# Altium schematic sheet INV.Power.SchDoc
size 1050 x 400 mm; SheetNumber: 1; SheetTotal: 3
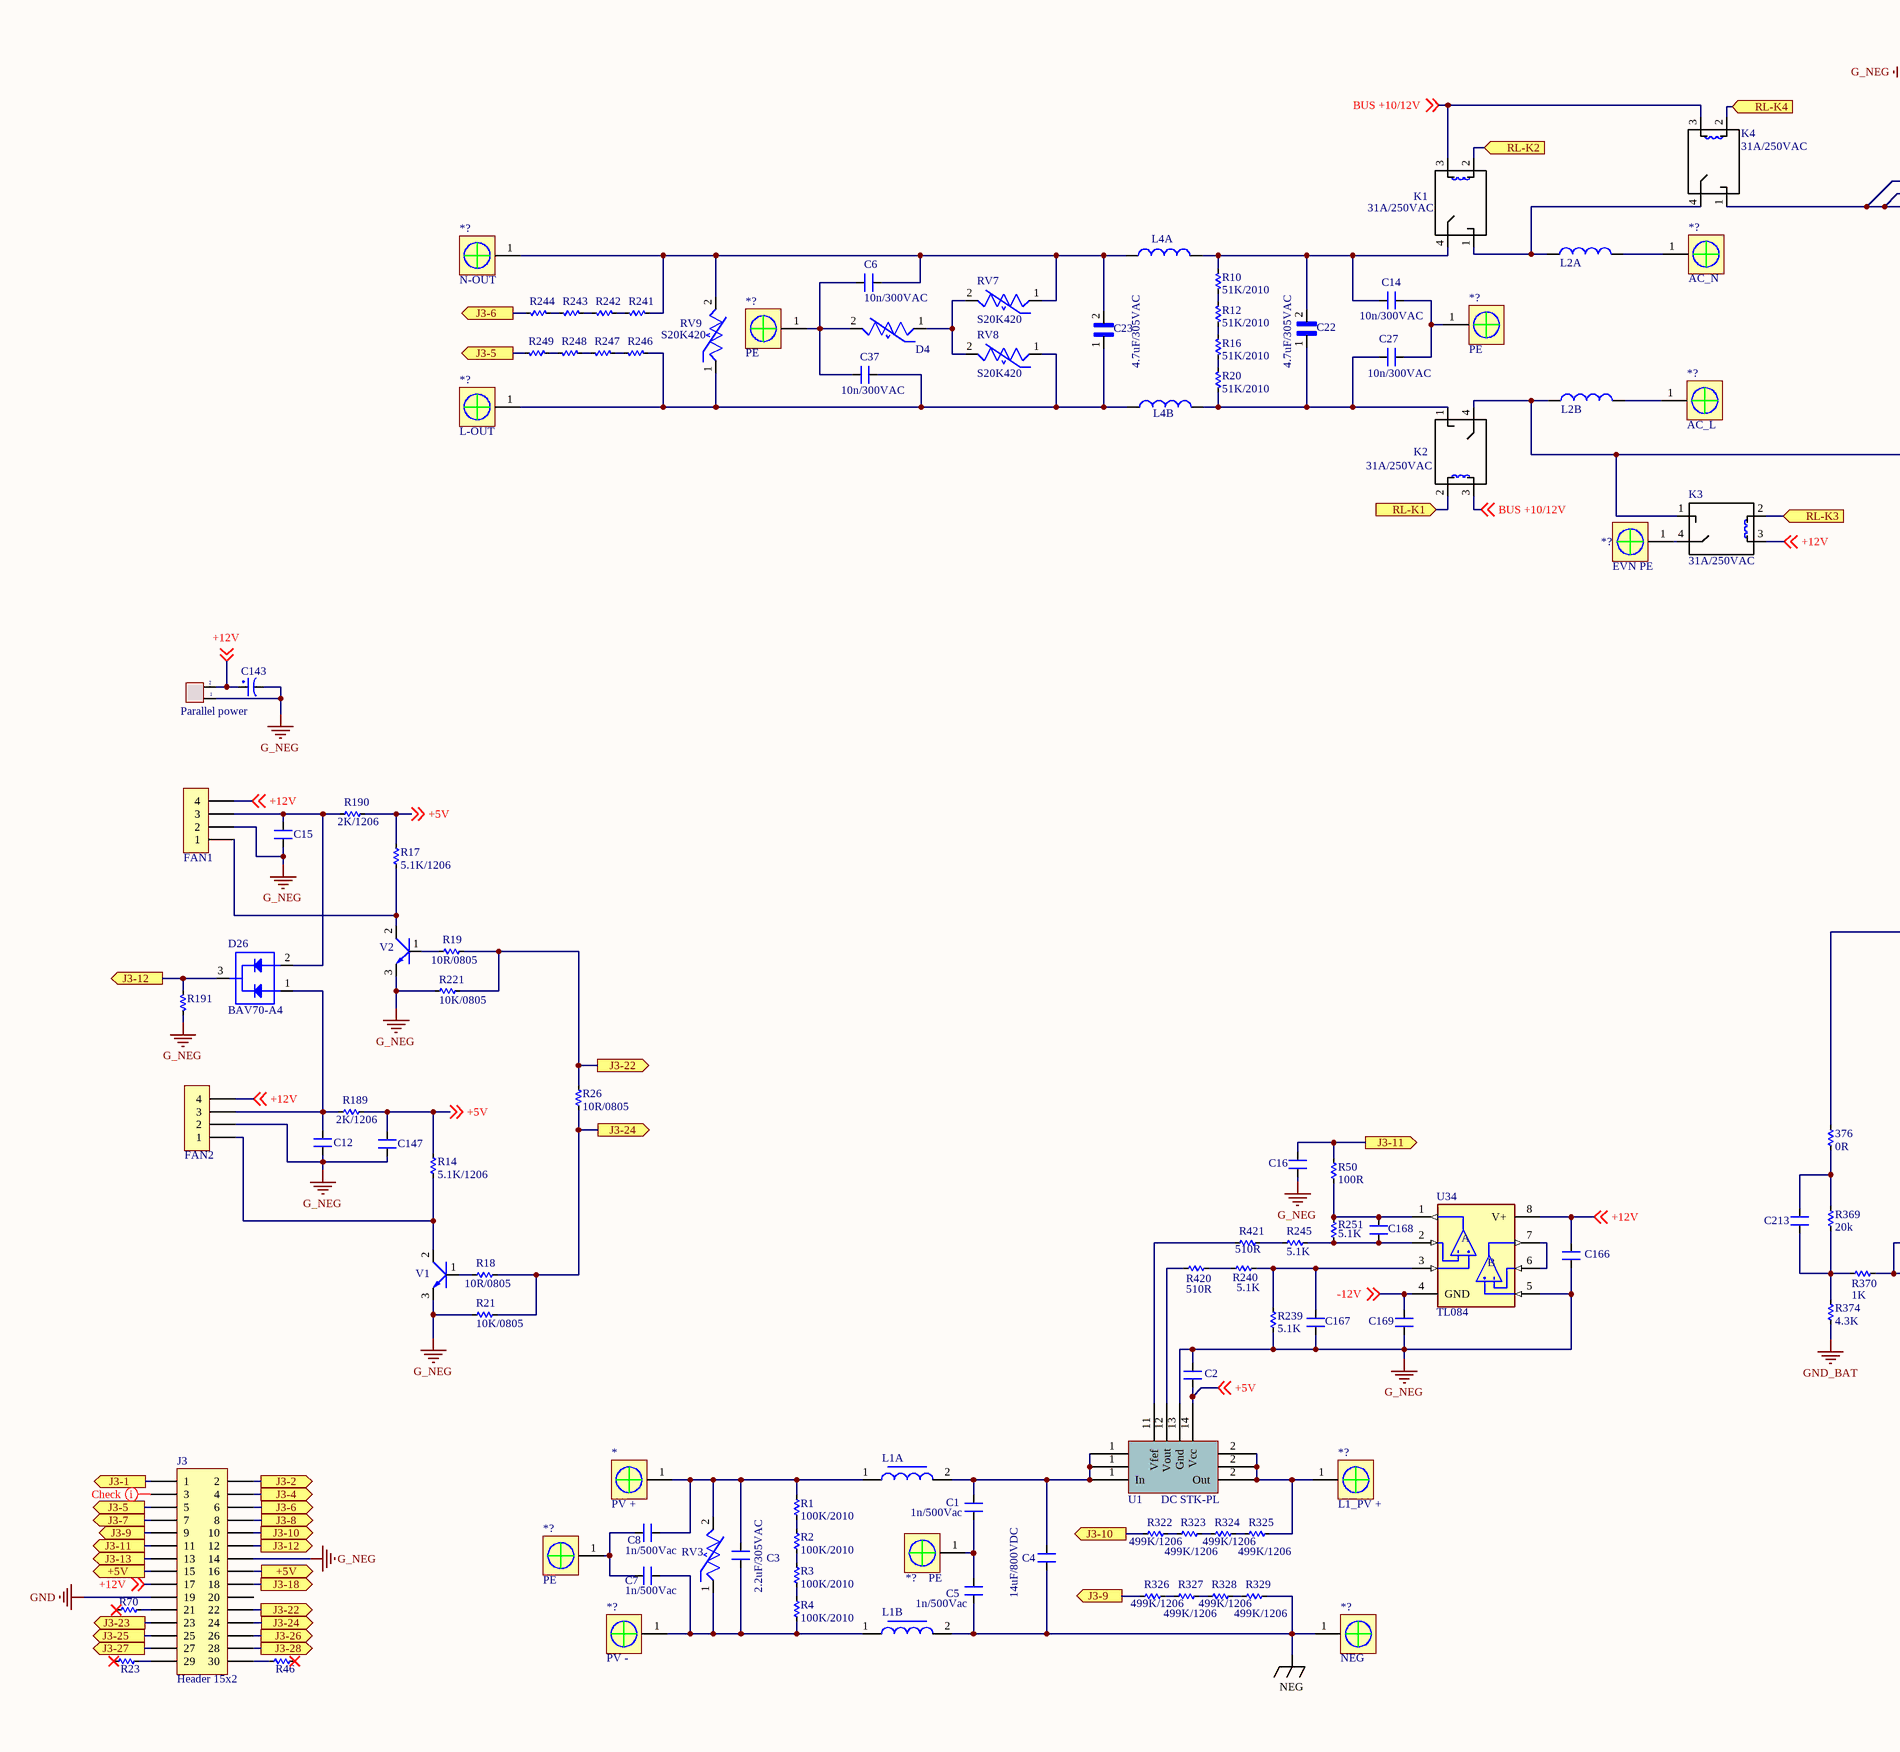
[diagram p0: INV.Power.SchDoc, left]
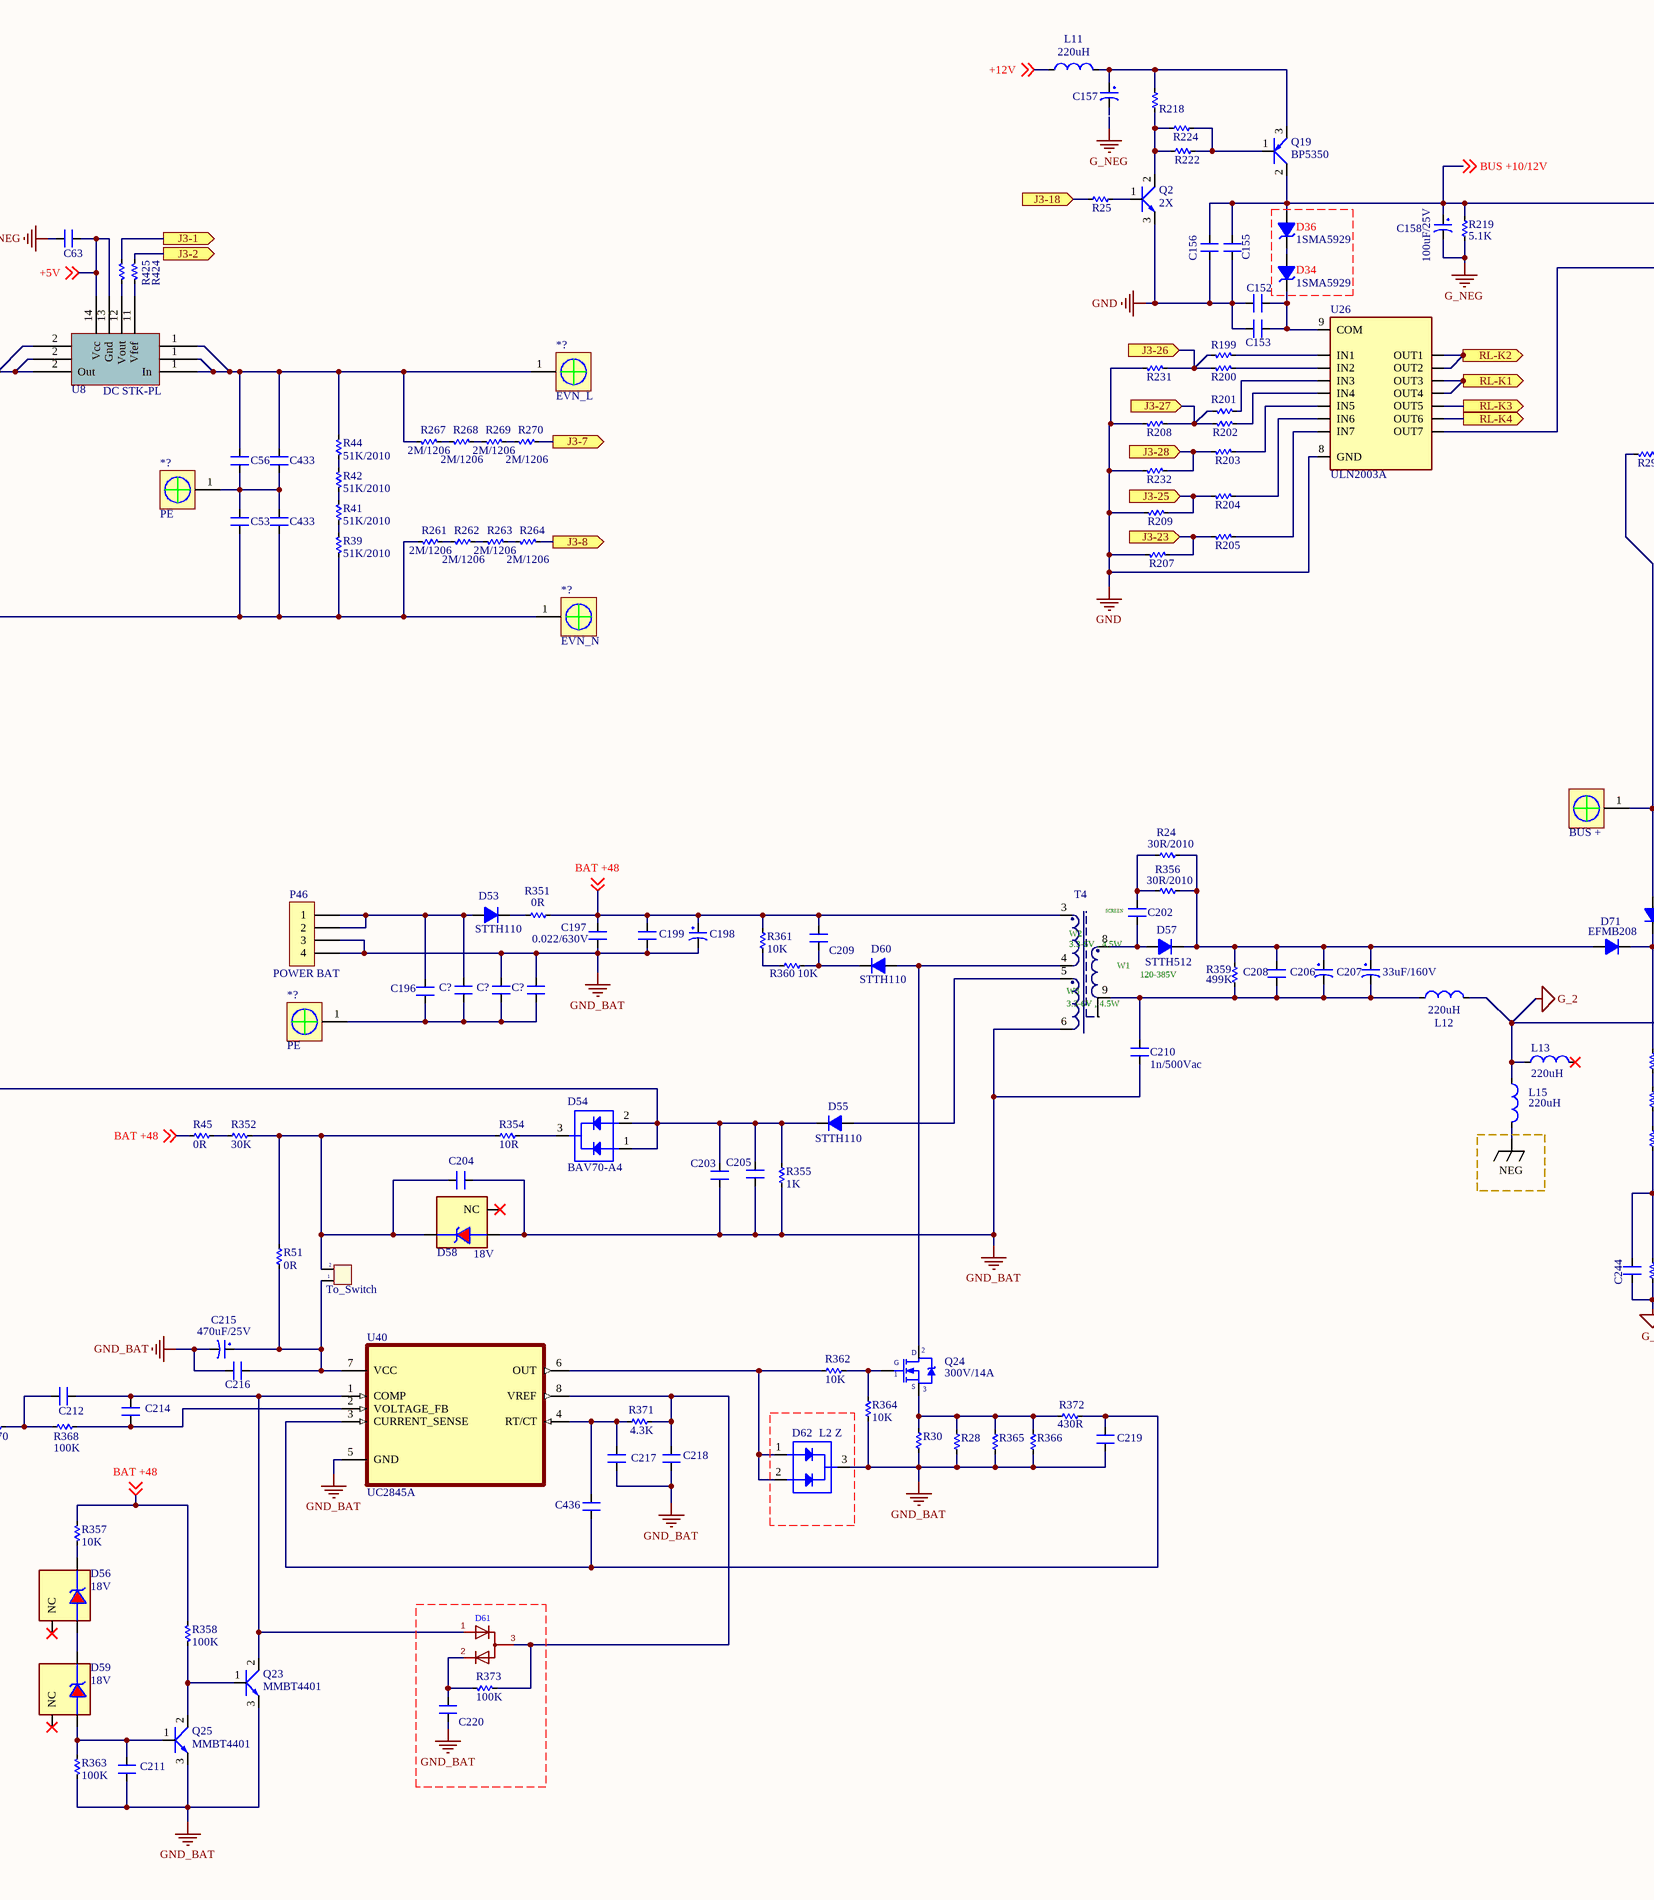
[diagram p1: INV.Power.SchDoc, middle]
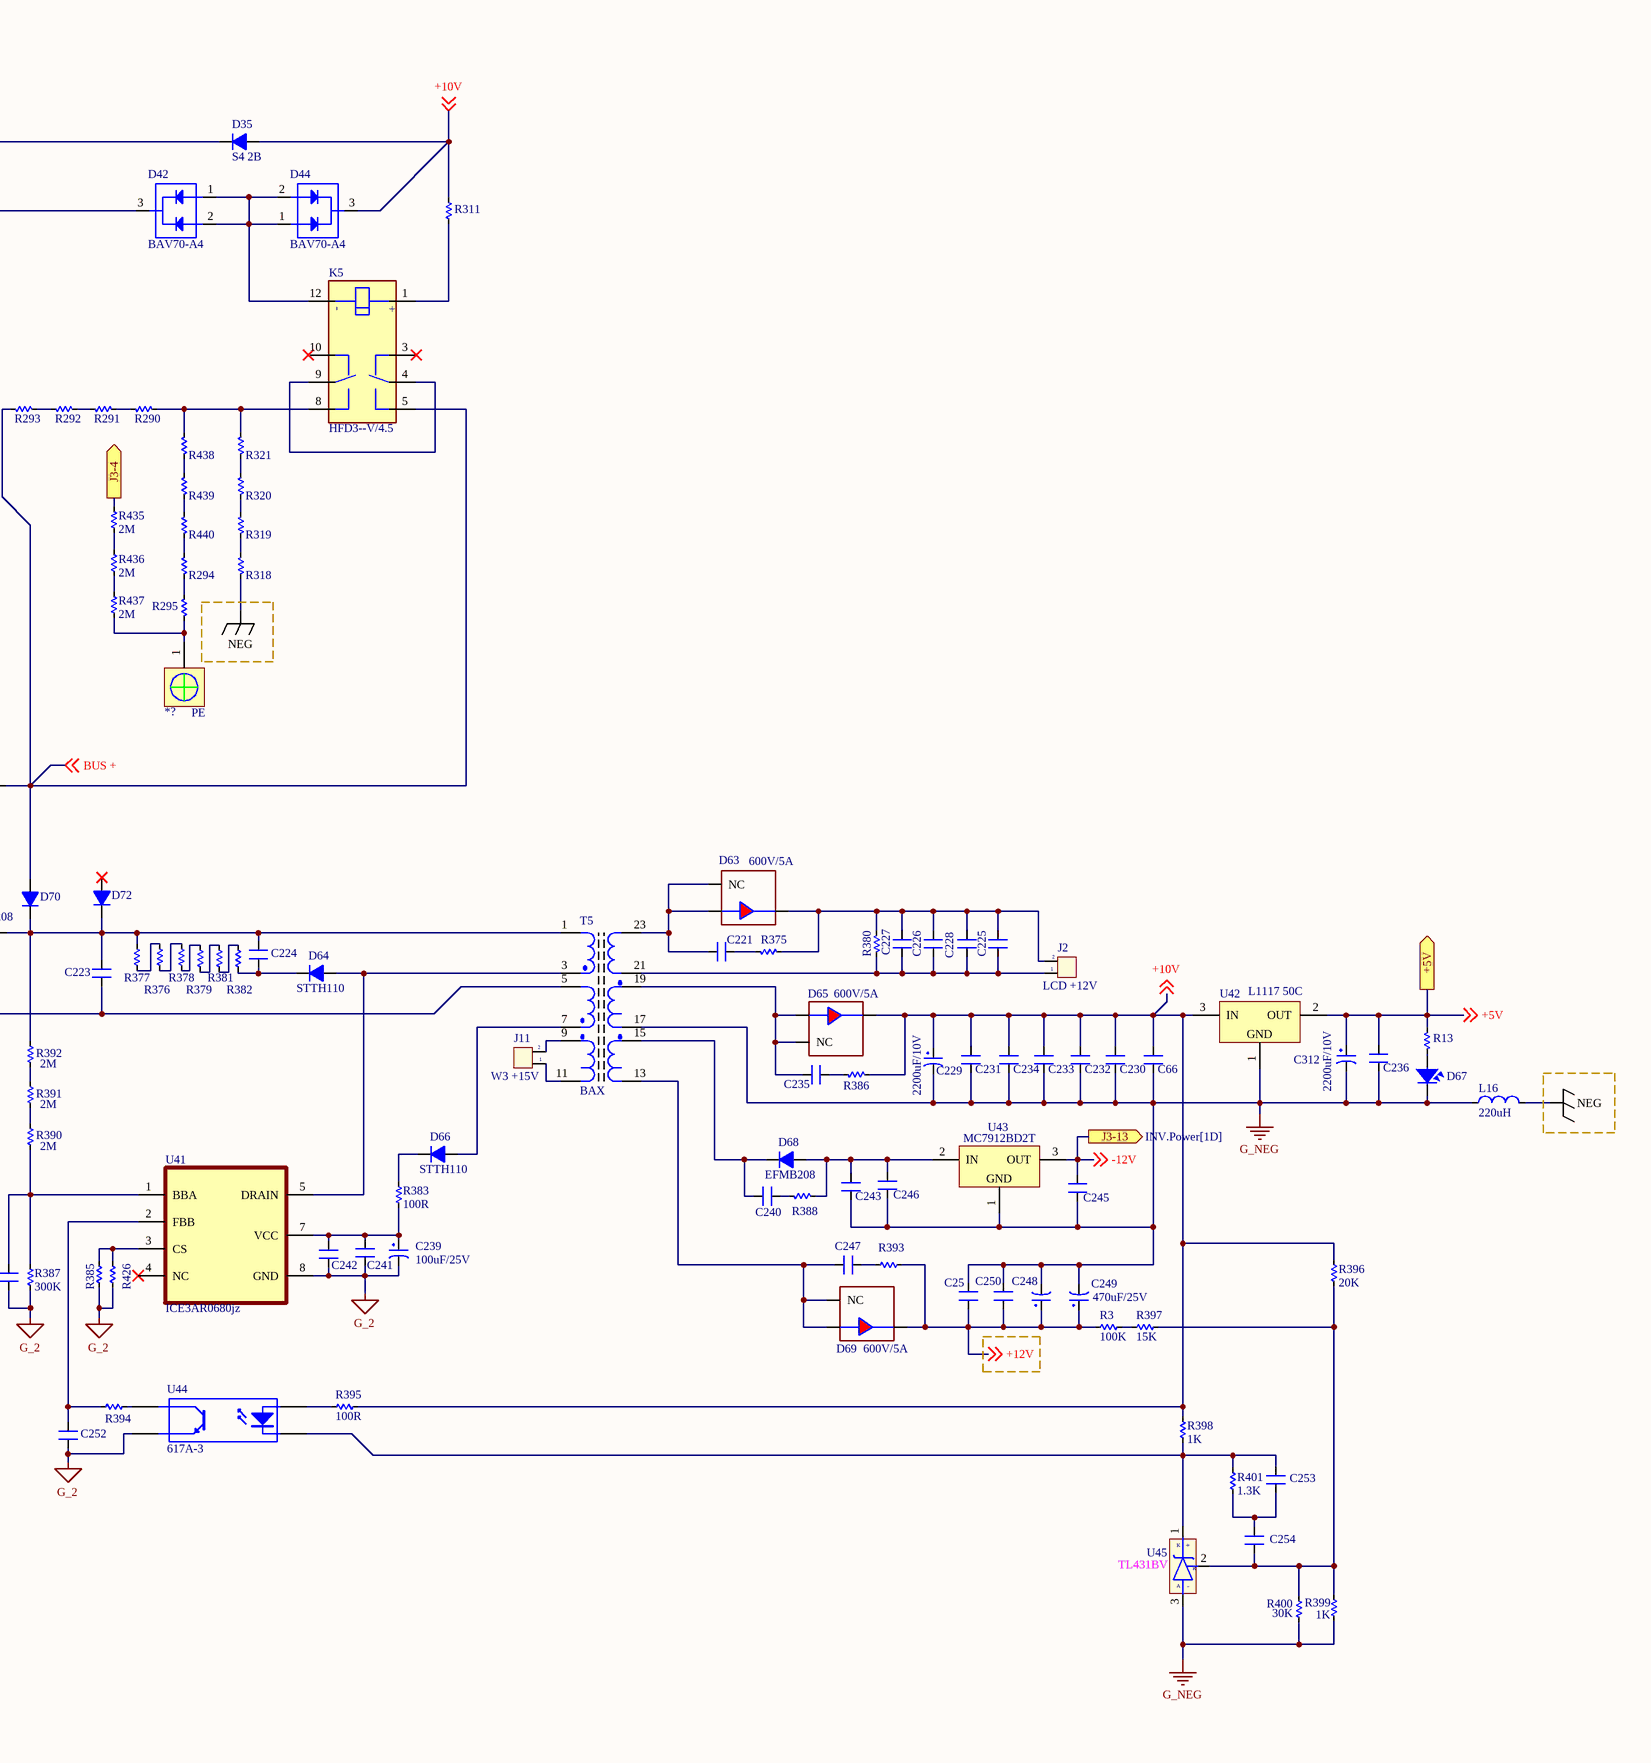
[diagram p2: INV.Power.SchDoc, right]

## Parts
(Parts that share a designator on the sheet are numbered #1, #2 ... from top to bottom, then left to right.)
376  0R  [RES-SMD-0603 EX]
*  PV +  [Copper Pipe]
*?#1  EVN_L  [Copper Pipe]
*?#2  N-OUT  [Copper Pipe]
*?#3  AC_N  [Copper Pipe]
*?#4  PE  [Copper Pipe]
*?#5  PE  [Copper Pipe]
*?#6  PE  [Copper Pipe]
*?#7  AC_L  [Copper Pipe]
*?#8  L-OUT  [Copper Pipe]
*?#9  EVN_N  [Copper Pipe]
*?#10  PE  [Copper Pipe]
*?#11  EVN PE  [Copper Pipe]
*?#12  PE  [Copper Pipe]
*?#13  L1_PV +  [Copper Pipe]
*?#14  PE  [Copper Pipe]
*?#15  PE  [Copper Pipe]
*?#16  PV -  [Copper Pipe]
*?#17  NEG  [Copper Pipe]
C1  1n/500Vac  [CAP-SMD-0805 EX]
C2  (no value)  [CAP-SMD-0805 EX]
C3  2.2uF/305VAC  [CAP-SMD-0805 EX]
C4  14uF/800VDC  [CAP-SMD-0805 EX]
C5  1n/500Vac  [CAP-SMD-0805 EX]
C6  10n/300VAC  [CAP-SMD-0805 EX]
C7  1n/500Vac  [CAP-SMD-0805 EX]
C8  1n/500Vac  [CAP-SMD-0805 EX]
C12  (no value)  [CAP-SMD-0805 EX]
C14  10n/300VAC  [CAP-SMD-0805 EX]
C15  (no value)  [CAP-SMD-0805 EX]
C16  (no value)  [CAP-SMD-0805 EX]
C22  4.7uF/305VAC  [CAPRR2250W80L2600T850H1500]
C23  4.7uF/305VAC  [CAPRR2250W80L2600T850H1500]
C25  (no value)  [CAP-SMD-0805 EX]
C27  10n/300VAC  [CAP-SMD-0805 EX]
C37  10n/300VAC  [CAP-SMD-0805 EX]
C53  10n/300VAC  [CAP-SMD-0805 EX]  (value not drawn)
C56  10n/300VAC  [CAP-SMD-0805 EX]  (value not drawn)
C63  10n/300VAC  [CAP-SMD-0805 EX]  (value not drawn)
C66  (no value)  [CAP-SMD-0805 EX]
C143  470uF/25V  [CAP-10X17-N]  (value not drawn)
C147  (no value)  [CAP-SMD-0805 EX]
C152  (no value)  [CAP-SMD-0805 EX]
C153  (no value)  [CAP-SMD-0805 EX]
C155  (no value)  [CAP-SMD-0805 EX]
C156  (no value)  [CAP-SMD-0805 EX]
C157  100uF/25V  [CAP-10X17-N]  (value not drawn)
C158  100uF/25V  [CAP-10X17-N]
C166  (no value)  [CAP-SMD-0805 EX]
C167  (no value)  [CAP-SMD-0805 EX]
C168  (no value)  [CAP-SMD-0805 EX]
C169  (no value)  [CAP-SMD-0805 EX]
C196  (no value)  [CAP-SMD-0805 EX]
C197  0.022/630V  [CAP-SMD-0805 EX]
C198  27uF/100V  [CAP-10X17-N]  (value not drawn)
C199  (no value)  [CAP-SMD-0805 EX]
C202  (no value)  [CAP-SMD-0805 EX]
C203  (no value)  [CAP-SMD-0805 EX]
C204  (no value)  [CAP-SMD-0805 EX]
C205  (no value)  [CAP-SMD-0805 EX]
C206  33uF/160V  [CAP-10X17-N]  (value not drawn)
C207  33uF/160V  [CAP-10X17-N]
C208  (no value)  [CAP-SMD-0805 EX]
C209  (no value)  [CAP-SMD-0805 EX]
C210  1n/500Vac  [CAP-SMD-0805 EX]
C211  (no value)  [CAP-SMD-0805 EX]
C212  (no value)  [CAP-SMD-0805 EX]
C213  (no value)  [CAP-SMD-0805 EX]
C214  (no value)  [CAP-SMD-0805 EX]
C215  470uF/25V  [CAP-10X17-N]
C216  (no value)  [CAP-SMD-0805 EX]
C217  (no value)  [CAP-SMD-0805 EX]
C218  (no value)  [CAP-SMD-0805 EX]
C219  (no value)  [CAP-SMD-0805 EX]
C220  (no value)  [CAP-SMD-0805 EX]
C221  (no value)  [CAP-SMD-0805 EX]
C223  2uF/600VDC  [CAP-SMD-0805 EX]  (value not drawn)
C224  223J630V  [CAP-SMD-0805 EX]  (value not drawn)
C225  223J630V  [CAP-SMD-0805 EX]  (value not drawn)
C226  223J630V  [CAP-SMD-0805 EX]  (value not drawn)
C227  223J630V  [CAP-SMD-0805 EX]  (value not drawn)
C228  223J630V  [CAP-SMD-0805 EX]  (value not drawn)
C229  2200uF/10V  [CAP-10X17-N]
C230  (no value)  [CAP-SMD-0805 EX]
C231  (no value)  [CAP-SMD-0805 EX]
C232  (no value)  [CAP-SMD-0805 EX]
C233  (no value)  [CAP-SMD-0805 EX]
C234  (no value)  [CAP-SMD-0805 EX]
C235  (no value)  [CAP-SMD-0805 EX]
C236  (no value)  [CAP-SMD-0805 EX]
C239  100uF/25V  [CAP-10X17-N]
C240  (no value)  [CAP-SMD-0805 EX]
C241  223J630V  [CAP-SMD-0805 EX]  (value not drawn)
C242  223J630V  [CAP-SMD-0805 EX]  (value not drawn)
C243  (no value)  [CAP-SMD-0805 EX]
C244  (no value)  [CAP-SMD-0805 EX]
C245  (no value)  [CAP-SMD-0805 EX]
C246  (no value)  [CAP-SMD-0805 EX]
C247  (no value)  [CAP-SMD-0805 EX]
C248  470uF/25V  [CAP-10X17-N]  (value not drawn)
C249  470uF/25V  [CAP-10X17-N]
C250  (no value)  [CAP-SMD-0805 EX]
C252  (no value)  [CAP-SMD-0805 EX]
C253  (no value)  [CAP-SMD-0805 EX]
C254  (no value)  [CAP-SMD-0805 EX]
C312  2200uF/10V  [CAP-10X17-N]
C433#1  10n/300VAC  [CAP-SMD-0805 EX]  (value not drawn)
C433#2  10n/300VAC  [CAP-SMD-0805 EX]  (value not drawn)
C436  (no value)  [CAP-SMD-0805 EX]
C?#1  (no value)  [CAP-SMD-0805 EX]
C?#2  (no value)  [CAP-SMD-0805 EX]
C?#3  (no value)  [CAP-SMD-0805 EX]
D4  EPCOS  [VAR_B72220S0301K101]  (value not drawn)
D26  BAV70-A4  [DIO_STTH2003CG-TR]
D34  1SMA5929  [DIODE ZENNER SOD123 *]
D35  S4 2B  [1N4148]
D36  1SMA5929  [DIODE ZENNER SOD123 *]
D42  BAV70-A4  [DIO_STTH2003CG-TR]
D44  BAV70-A4  [DIO_STTH2003CG-TR]
D53  STTH110  [1N4148]
D54  BAV70-A4  [DIO_STTH2003CG-TR]
D55  STTH110  [1N4148]
D56  18V  [SOT95P237X112-3N]
D57  STTH512  [1N4148]
D58  18V  [SOT95P237X112-3N]
D59  18V  [SOT95P237X112-3N]
D60  STTH110  [1N4148]
D61  Dual-Diode_CA_1  [SOT-23]  (value not drawn)
D62  L2 Z  [DIO_STTH2003CG-TR]
D63  600V/5A  [SOT95P237X112-3N]
D64  STTH110  [1N4148]
D65  600V/5A  [SOT95P237X112-3N]
D66  STTH110  [1N4148]
D67  LED  [LED 2835 NEW]  (value not drawn)
D68  EFMB208  [1N4148]
D69  600V/5A  [SOT95P237X112-3N]
D70  EFMB208  [1N4148]  (value not drawn)
D71  EFMB208  [1N4148]
D72  EFMB208  [1N4148]  (value not drawn)
H?#1  FAN1  [XH2.54M-4]
H?#2  FAN2  [XH2.54M-4]
J2  LCD +12V  [Jump2]
J3  Header 15x2  [Head 1X16 - CAI THANG]
J4  Parallel power  [Jump2]
J11  W3 +15V  [Jump2]
J?  To_Switch  [Jump2]
K1  31A/250VAC  [RELAY 10A/250V]
K2  31A/250VAC  [RELAY 10A/250V]
K3  31A/250VAC  [RELAY 10A/250V]
K4  31A/250VAC  [RELAY 10A/250V]
K5  HFD3--V/4.5  [HFD3]
L1A  L  [Cuan Cam PWM Hybrid]  (value not drawn)
L1B  L  [Cuan Cam PWM Hybrid]  (value not drawn)
L2A  Cuộn L  [IND_1210]  (value not drawn)
L2B  Cuộn L  [IND_1210]  (value not drawn)
L4A  Cuộn L  [IND_1210]  (value not drawn)
L4B  Cuộn L  [IND_1210]  (value not drawn)
L11  220uH  [CUON LOC 1010]
L12  220uH  [CUON LOC 1010]
L13  220uH  [CUON LOC 1010]
L15  220uH  [CUON LOC 1010]
L16  220uH  [CUON LOC 1010]
P46  POWER BAT  [XH2.54M-4]
PV_+?  BUS +  [Copper Pipe]
Q2  2X
Q19  BP5350  [QTO-92]
Q23  MMBT4401
Q24  300V/14A  [TO220H1]
Q25  MMBT4401
R1  100K/2010  [RES-SMD-0603 EX]
R2  100K/2010  [RES-SMD-0603 EX]
R3#1  100K  [RES-SMD-0603 EX]
R3#2  100K/2010  [RES-SMD-0603 EX]
R4  100K/2010  [RES-SMD-0603 EX]
R10  51K/2010  [RES-SMD-0603 EX]
R12  51K/2010  [RES-SMD-0603 EX]
R13  5.1K  [RES-SMD-0603 EX]  (value not drawn)
R14  5.1K/1206  [RES-SMD-0603 EX]
R16  51K/2010  [RES-SMD-0603 EX]
R17  5.1K/1206  [RES-SMD-0603 EX]
R18  10R/0805  [RES-SMD-0603 EX]
R19  10R/0805  [RES-SMD-0603 EX]
R20  51K/2010  [RES-SMD-0603 EX]
R21  10K/0805  [RES-SMD-0603 EX]
R23  (no value)  [RES-SMD-0603 EX]
R24  30R/2010  [RES-SMD-0603 EX]
R25  20K  [RES-SMD-0603 EX]  (value not drawn)
R26  10R/0805  [RES-SMD-0603 EX]
R28  0.33R/2010  [RES-SMD-0603 EX]  (value not drawn)
R30  0.33R/2010  [RES-SMD-0603 EX]  (value not drawn)
R39  51K/2010  [RES-SMD-0603 EX]
R41  51K/2010  [RES-SMD-0603 EX]
R42  51K/2010  [RES-SMD-0603 EX]
R44  51K/2010  [RES-SMD-0603 EX]
R45  0R  [RES-SMD-0603 EX]
R46  (no value)  [RES-SMD-0603 EX]
R50  100R  [RES-SMD-0603 EX]
R51  0R  [RES-SMD-0603 EX]
R70  (no value)  [RES-SMD-0603 EX]
R189  2K/1206  [RES-SMD-0603 EX]
R190  2K/1206  [RES-SMD-0603 EX]
R191  5.1K/1206  [RES-SMD-0603 EX]  (value not drawn)
R199  10R  [RES-SMD-0603 EX]  (value not drawn)
R200  10R  [RES-SMD-0603 EX]  (value not drawn)
R201  10R  [RES-SMD-0603 EX]  (value not drawn)
R202  10R  [RES-SMD-0603 EX]  (value not drawn)
R203  10R  [RES-SMD-0603 EX]  (value not drawn)
R204  10R  [RES-SMD-0603 EX]  (value not drawn)
R205  10R  [RES-SMD-0603 EX]  (value not drawn)
R207  5.1K  [RES-SMD-0603 EX]  (value not drawn)
R208  5.1K  [RES-SMD-0603 EX]  (value not drawn)
R209  5.1K  [RES-SMD-0603 EX]  (value not drawn)
R218  10K  [RES-SMD-0603 EX]  (value not drawn)
R219  5.1K  [RES-SMD-0603 EX]
R221  10K/0805  [RES-SMD-0603 EX]
R222  2K  [RES-SMD-0603 EX]  (value not drawn)
R224  2K  [RES-SMD-0603 EX]  (value not drawn)
R231  5.1K  [RES-SMD-0603 EX]  (value not drawn)
R232  5.1K  [RES-SMD-0603 EX]  (value not drawn)
R239  5.1K  [RES-SMD-0603 EX]
R240  5.1K  [RES-SMD-0603 EX]
R241  2M/1206  [RES-SMD-0603 EX]  (value not drawn)
R242  2M/1206  [RES-SMD-0603 EX]  (value not drawn)
R243  2M/1206  [RES-SMD-0603 EX]  (value not drawn)
R244  2M/1206  [RES-SMD-0603 EX]  (value not drawn)
R245  5.1K  [RES-SMD-0603 EX]
R246  2M/1206  [RES-SMD-0603 EX]  (value not drawn)
R247  2M/1206  [RES-SMD-0603 EX]  (value not drawn)
R248  2M/1206  [RES-SMD-0603 EX]  (value not drawn)
R249  2M/1206  [RES-SMD-0603 EX]  (value not drawn)
R251  5.1K  [RES-SMD-0603 EX]
R261  2M/1206  [RES-SMD-0603 EX]
R262  2M/1206  [RES-SMD-0603 EX]
R263  2M/1206  [RES-SMD-0603 EX]
R264  2M/1206  [RES-SMD-0603 EX]
R267  2M/1206  [RES-SMD-0603 EX]
R268  2M/1206  [RES-SMD-0603 EX]
R269  2M/1206  [RES-SMD-0603 EX]
R270  2M/1206  [RES-SMD-0603 EX]
R290  499K  [RES-SMD-0603 EX]  (value not drawn)
R291  499K  [RES-SMD-0603 EX]  (value not drawn)
R292  499K  [RES-SMD-0603 EX]  (value not drawn)
R293  499K  [RES-SMD-0603 EX]  (value not drawn)
R294  200K  [RES-SMD-0603 EX]  (value not drawn)
R295  200K  [RES-SMD-0603 EX]  (value not drawn)
R311  51R  [RES-SMD-0603 EX]  (value not drawn)
R318  499K  [RES-SMD-0603 EX]  (value not drawn)
R319  499K  [RES-SMD-0603 EX]  (value not drawn)
R320  499K  [RES-SMD-0603 EX]  (value not drawn)
R321  499K  [RES-SMD-0603 EX]  (value not drawn)
R322  499K/1206  [RES-SMD-0603 EX]
R323  499K/1206  [RES-SMD-0603 EX]
R324  499K/1206  [RES-SMD-0603 EX]
R325  499K/1206  [RES-SMD-0603 EX]
R326  499K/1206  [RES-SMD-0603 EX]
R327  499K/1206  [RES-SMD-0603 EX]
R328  499K/1206  [RES-SMD-0603 EX]
R329  499K/1206  [RES-SMD-0603 EX]
R351  0R  [RES-SMD-0603 EX]
R352  30K  [RES-SMD-0603 EX]
R354  10R  [RES-SMD-0603 EX]
R355  1K  [RES-SMD-0603 EX]
R356  30R/2010  [RES-SMD-0603 EX]
R357  10K  [RES-SMD-0603 EX]
R358  100K  [RES-SMD-0603 EX]
R359  499K  [RES-SMD-0603 EX]
R360  10K  [RES-SMD-0603 EX]
R361  10K  [RES-SMD-0603 EX]
R362  10K  [RES-SMD-0603 EX]
R363  100K  [RES-SMD-0603 EX]
R364  10K  [RES-SMD-0603 EX]
R365  0.33R/2010  [RES-SMD-0603 EX]  (value not drawn)
R366  0.33R/2010  [RES-SMD-0603 EX]  (value not drawn)
R368  100K  [RES-SMD-0603 EX]
R369  20k  [RES-SMD-0603 EX]
R370  1K  [RES-SMD-0603 EX]
R371  4.3K  [RES-SMD-0603 EX]
R372  430R  [RES-SMD-0603 EX]
R373  100K  [RES-SMD-0603 EX]
R374  4.3K  [RES-SMD-0603 EX]
R375  10K/2010  [RES-SMD-0603 EX]  (value not drawn)
R376  10K/2010  [RES-SMD-0603 EX]  (value not drawn)
R377  10K/2010  [RES-SMD-0603 EX]  (value not drawn)
R378  10K/2010  [RES-SMD-0603 EX]  (value not drawn)
R379  10K/2010  [RES-SMD-0603 EX]  (value not drawn)
R380  10K/2010  [RES-SMD-0603 EX]  (value not drawn)
R381  10K/2010  [RES-SMD-0603 EX]  (value not drawn)
R382  10K/2010  [RES-SMD-0603 EX]  (value not drawn)
R383  100R  [RES-SMD-0603 EX]
R385  0.33R/2010  [RES-SMD-0603 EX]  (value not drawn)
R386  10K/2010  [RES-SMD-0603 EX]  (value not drawn)
R387  300K  [RES-SMD-0603 EX]
R388  150R/1206  [RES-SMD-0603 EX]  (value not drawn)
R390  2M  [RES-SMD-0603 EX]
R391  2M  [RES-SMD-0603 EX]
R392  2M  [RES-SMD-0603 EX]
R393  150R/1206  [RES-SMD-0603 EX]  (value not drawn)
R394  22R  [RES-SMD-0603 EX]  (value not drawn)
R395  100R  [RES-SMD-0603 EX]
R396  20K  [RES-SMD-0603 EX]
R397  15K  [RES-SMD-0603 EX]
R398  1K  [RES-SMD-0603 EX]
R399  1K  [RES-SMD-0603 EX]
R400  30K  [RES-SMD-0603 EX]
R401  1.3K  [RES-SMD-0603 EX]
R420  510R  [RES-SMD-0603 EX]
R421  510R  [RES-SMD-0603 EX]
R424  1K/0603  [RES-SMD-0603 EX]  (value not drawn)
R425  1K/0603  [RES-SMD-0603 EX]  (value not drawn)
R426  0.33R/2010  [RES-SMD-0603 EX]  (value not drawn)
R435  2M  [RES-SMD-0603 EX]
R436  2M  [RES-SMD-0603 EX]
R437  2M  [RES-SMD-0603 EX]
R438  200K  [RES-SMD-0603 EX]  (value not drawn)
R439  200K  [RES-SMD-0603 EX]  (value not drawn)
R440  200K  [RES-SMD-0603 EX]  (value not drawn)
RV3  S20K420  [VAR_B72220S0301K101]  (value not drawn)
RV7  S20K420  [VAR_B72220S0301K101]
RV8  S20K420  [VAR_B72220S0301K101]
RV9  S20K420  [VAR_B72220S0301K101]
T4  (no value)  [EE16/7/4 (E16)]
T5  BAX  [BAX_DVD3]
U1  DC STK-PL  [Bien ap do Current]
U8  DC STK-PL  [Bien ap do Current]
U26  ULN2003A  [TSSOP-16-TI]
U34  TL084  [DIP794W45P254L959H508Q8]
U40  UC2845A  [SOIC127P600X175-8N]
U41  ICE3AR0680jz  [SOIC127P600X175-8N]
U42  L1117 50C  [SOT89N (3D)]
U43  MC7912BD2T  [HDR1x3 BIG]
U44  617A-3  [OPTO TRANSISTOR_SOP-4]
U45  TL431BV  [TL431]
V1  (no value)
V2  (no value)

## Ports
+5V (out, see INV.ControlMCU[1D], INV.Main[1D], INV.Main[3A], INV.Main[3D], INV.Main[4A], INV.Power[1D]), +5V (out, see INV.ControlMCU[1D], INV.Main[1D], INV.Main[3A], INV.Main[3D], INV.Main[4A], INV.Power[1D], INV.Power[6C]), J3-1 (out, see INV.Power[1D]), J3-1 (out, see INV.Power[3A]), J3-2 (out, see INV.Power[1D]), J3-2 (out, see INV.Power[3A]), J3-4 (out, see INV.Power[1D]), J3-4 (out, see INV.Power[5B]), J3-5 (out, see INV.Power[1B]), J3-5 (out, see INV.Power[1D]), J3-6 (out, see INV.Power[1A]), J3-6 (out, see INV.Power[1D]), J3-7 (out, see INV.Power[1D]), J3-7 (out, see INV.Power[3A]), J3-8 (out, see INV.Power[1D]), J3-8 (out, see INV.Power[3B]), J3-9 (out, see INV.Power[1D]), J3-9 (out, see INV.Power[2D]), J3-10 (out, see INV.Power[1D]), J3-10 (out, see INV.Power[2D]), J3-11 (out, see INV.Power[1D]), J3-11 (out, see INV.Power[2C]), J3-12 (out, see INV.Power[1C]), J3-12 (out, see INV.Power[1D]), J3-13 (out, see INV.Power[1D]), J3-13 (out, see INV.Power[6C]), J3-18 (in, see INV.Power[1D]), J3-18 (out, see INV.Power[4A]), J3-22 (out, see INV.Power[1C]), J3-22 (out, see INV.Power[1D]), J3-23 (in, see INV.Power[1D]), J3-23 (out, see INV.Power[4B]), J3-24 (out, see INV.Power[1C]), J3-24 (out, see INV.Power[1D]), J3-25 (in, see INV.Power[1D]), J3-25 (out, see INV.Power[4B]), J3-26 (in, see INV.Power[1D]), J3-26 (out, see INV.Power[4A]), J3-27 (in, see INV.Power[1D]), J3-27 (out, see INV.Power[4A]), J3-28 (in, see INV.Power[1D]), J3-28 (out, see INV.Power[4A]), RL-K1 (in, see INV.Power[4A]), RL-K1 (out, see INV.Power[2B]), RL-K2 (in, see INV.Power[4A]), RL-K2 (out, see INV.Power[2A]), RL-K3 (in, see INV.Power[4A]), RL-K3 (out, see INV.Power[3B]), RL-K4 (in, see INV.Power[4A]), RL-K4 (out, see INV.Power[3A])

## Nets
G_2: C223.1 C239.2 C241.2 C242.2 C244.1 C252.1 L12.2 L13.2 L15.2 R385.2 R387.1 R426.2 T5.5 U41.8(GND) U44.3
G_NEG: C2.2 C12.1 C15.1 C16.2 C25.1 C63.1 C66.2 C143.2 C147.1 C158.2 C166.2 C167.2 C169.2 C229.2 C230.2 C231.2 C232.2 C233.2 C234.2 C236.2 C243.1 C245.1 C246.1 C248.2 C249.2 C250.1 C312.2 D67.2 H?#1.2 H?#2.2 J3.14 J4.1 L16.1 R21.2 R191.1 R219.1 R221.2 R239.2 R399.1 R400.1 T5.17 U1.13(Gnd) U34.5(+INB) U42.1(GND) U43.1(GND) U45.3(-) V1.3(E) V2.3(E)
GND: C152.1 C153.1 C155.1 C156.1 J3.19 Q2.3(E) R207.2 R208.2 R209.2 R231.2 R232.2 U26.8(GND)
GND_BAT: C197.1 C198.2 C199.1 C203.1 C204.1 C205.1 C210.2 C211.2 C215.2 C216.1 C217.1 C218.1 C219.1 C220.1 C?#2.2 C?#3.2 D58.1(A) D62.3(K) P46.3 P46.4 Q23.3(E) Q25.3(E) R28.2 R30.2 R355.2 R363.2 R364.2 R365.2 R366.2 R374.2 T4.6 U40.5(GND)
NEG: *?#17.1 C4.1 C5.2 L1B.2 L15.1 L16.2 R318.2 R329.1
+5V: C2.1 C63.2 C147.2 C236.1 C312.1 J3.15 J3.16 R13.2 R14.2 R17.2 R189.2 R190.2 U1.14(Vcc) U8.13(Gnd) U8.14(Vcc) U42.2(OUT) ; off-sheet +5V, port +5V
+10V: C66.1 C229.1 C230.1 C231.1 C232.1 C233.1 C234.1 D35.1(A) D44.3(K) D65.3(K) R311.1 R386.1 R395.1 R396.1 R398.1 U42.3(IN) ; off-sheet +10V
+12V: C25.2 C143.1 C166.1 C248.1 C249.1 C250.2 D69.3(K) H?#1.4 H?#2.4 J3.17 J4.2 K3.3 L11.1 R3#1.2 R393.1 U34.8(V+) ; off-sheet +12V
-12V: C169.1 C245.2 J3.13 U34.4(GND) U43.3(OUT) ; off-sheet -12V, port J3-13
BAT +48: C197.2 C198.1 C199.2 C209.1 R45.1 R351.2 R357.2 R358.1 R361.1 T4.3 ; off-sheet BAT +48
BUS +: D70.1(A) K5.5 PV_+?.1 R293.1 ; off-sheet BUS +
BUS +10/12V: C155.2 C156.2 C158.1 D35.2(K) D36.2(A) K1.3 K2.3 K4.3 Q19.2(C) R219.2 ; off-sheet BUS +10/12V
J3-1: J3.1 R425.1 ; port J3-1
J3-2: J3.2 R424.1 ; port J3-2
J3-4: J3.4 R435.2 ; port J3-4
J3-5: J3.5 R249.2 ; port J3-5
J3-6: J3.6 R244.2 ; port J3-6
J3-7: J3.7 R270.2 ; port J3-7
J3-8: J3.8 R264.2 ; port J3-8
J3-9: J3.9 R326.1 ; port J3-9
J3-10: J3.10 R322.1 ; port J3-10
J3-11: C16.1 J3.11 R50.2 ; port J3-11
J3-12: D26.3(K) J3.12 R191.2 ; port J3-12
J3-18: J3.18 R25.1 ; port J3-18
J3-22: J3.22 R19.1 R26.1 R221.1 ; port J3-22
J3-23: J3.23 R205.2 R207.1 ; port J3-23
J3-24: J3.24 R18.1 R21.1 R26.2 ; port J3-24
J3-25: J3.25 R204.2 R209.1 ; port J3-25
J3-26: J3.26 R199.2 R200.2 R231.1 ; port J3-26
J3-27: J3.27 R201.2 R202.2 R208.1 ; port J3-27
J3-28: J3.28 R203.2 R232.1 ; port J3-28
RL-K1: K2.2 U26.13(OUT4) U26.14(OUT3) ; port RL-K1
RL-K2: K1.2 U26.15(OUT2) U26.16(OUT1) ; port RL-K2
RL-K3: K3.2 U26.12(OUT5) ; port RL-K3
RL-K4: K4.2 U26.11(OUT6) ; port RL-K4
Net376_1: 376.1 C203.2 C205.2 D54.1(A1) D54.2(A2) D55.2(K) R355.1
Net376_2: 376.2 C213.2 R369.1
Net*?#1_1: *?#1.1 C56.1 C433#1.1 R44.1 R267.1 U8.1(In)
Net*?#2_1: *?#2.1 C6.1 C23.2 L4A.2 R241.1 RV7.1 RV9.2
Net*?#3_1: *?#3.1 L2A.1
Net*?#4_1: *?#4.1 C6.2 C37.2 D4.2
Net*?#5_1: *?#5.1 C14.2 C27.1
Net*?#6_1: *?#6.1 C53.1 C56.2 C433#1.2 C433#2.1
Net*?#7_1: *?#7.1 L2B.1
Net*?#8_1: *?#8.1 C23.1 C37.1 L4B.2 R246.1 RV8.1 RV9.1
Net*?#9_1: *?#9.1 C53.2 C433#2.2 K2.4 K3.1 L2B.2 R39.2 R261.1
Net*?#10_1: *?#10.1 R295.2 R437.1
Net*?#11_1: *?#11.1 K3.4
Net*?#12_1: *?#12.1 C196.1 C?#1.1 C?#2.1 C?#3.1
Net*?#13_1: *?#13.1 R325.1 U1.2(Out)
Net*?#14_1: *?#14.1 C7.1 C8.1
Net*?#15_1: *?#15.1 C1.1 C5.1
Net*?#16_1: *?#16.1 C3.1 C7.2 L1B.1 R4.1 RV3.1
Net*_1: *.1 C3.2 C8.2 L1A.1 R1.1 RV3.2
NetC1_2: C1.2 C4.2 L1A.2 U1.1(In)
NetC12_2: C12.2 D26.1(A1) H?#2.3 R189.1
NetC14_1: C14.1 C22.2 K1.4 L4A.1 R10.1
NetC15_2: C15.2 D26.2(A2) H?#1.3 R190.1
NetC22_1: C22.1 C27.2 K2.1 L4B.1 R20.2
NetC152_2: C152.2 C153.2 D34.1(K) U26.9(COM)
NetC157_1: C157.1 L11.2 Q19.3(E) R218.2
NetC167_1: C167.1 R239.1 R240.2 U34.3(+INA)
NetC168_1: C168.1 R245.1 R251.1 U34.2(-INA)
NetC168_2: C168.2 R50.1 R251.2 U34.1(OUTA)
NetC196_2: C196.2 C?#1.2 D53.1(A) P46.1 P46.2
NetC202_1: C202.1 D57.1(A) T4.8
NetC202_2: C202.2 R24.1 R356.1
NetC204_2: C204.2 D58.3(K) J?.2 R51.1 R352.2 R354.1
NetC206_1: C206.1 C207.1 C208.1 D57.2(K) D71.1(A) R24.2 R356.2 R359.1
NetC206_2: C206.2 C207.2 C208.2 C210.1 L12.1 R359.2 T4.9
NetC209_2: C209.2 D60.2(K) R360.1
NetC211_1: C211.1 D59.1(A) Q25.1(B) R363.1
NetC212_1: C212.1 R368.2 R370.1
NetC212_2: C212.2 C214.1 D61.1(C) Q23.2(C) U40.1(COMP)
NetC213_1: C213.1 R369.2 R370.2 R374.1
NetC214_2: C214.2 R368.1 U40.2(VOLTAGE_FB)
NetC215_1: C215.1 C216.2 J?.1 R51.2 U40.7(VCC)
NetC217_2: C217.2 C436.2 R371.1 U40.4(RT/CT)
NetC218_2: C218.2 D61.3(A) R371.2 R373.1 U40.8(VREF)
NetC219_2: C219.2 C436.1 R372.2 U40.3(CURRENT_SENSE)
NetC220_2: C220.2 D61.2(C) R373.2
NetC221_1: C221.1 D63.1(A) D63.2(NC) T5.23
NetC221_2: C221.2 R375.1
NetC223_2: C223.2 C224.2 D70.2(K) D71.2(K) D72.2(K) R377.2 R392.2 T5.1
NetC224_1: C224.1 D64.2(K) R382.1
NetC225_1: C225.1 C226.1 C227.1 C228.1 D63.3(K) J2.2 R375.2 R380.1
NetC225_2: C225.2 C226.2 C227.2 C228.2 J2.1 R380.2 T5.21
NetC235_1: C235.1 R386.2
NetC235_2: C235.2 D65.1(A) D65.2(NC) T5.19
NetC239_1: C239.1 C241.1 C242.1 R383.2 U41.7(VCC)
NetC240_1: C240.1 R388.2
NetC240_2: C240.2 D68.2(K) T5.15
NetC243_2: C243.2 C246.2 D68.1(A) R388.1 U43.2(IN)
NetC244_2: C244.2 R387.2 R390.1 U41.1(BBA)
NetC247_1: C247.1 R393.2
NetC247_2: C247.2 D69.1(A) D69.2(NC) T5.13
NetC252_2: C252.2 R394.1 U41.2(FBB)
NetC253_1: C253.1 R398.2 R401.1 U44.2 U45.1(+)
NetC253_2: C253.2 C254.1 R401.2
NetC254_2: C254.2 R396.2 R397.1 R399.2 R400.2 U45.2(adj)
NetD4_1: D4.1 RV7.2 RV8.2
NetD34_2: D34.2(A) D36.1(K)
NetD42_1: D42.1(A1) D42.2(A2) D44.1(A1) D44.2(A2) K5.12
NetD42_3: D42.3(K) U26.10(OUT7)
NetD53_2: D53.2(K) R351.1
NetD54_3: D54.3(K) R354.2
NetD55_1: D55.1(A) T4.5
NetD56_1: D56.1(A) D59.3(K)
NetD56_3: D56.3(K) R357.1
NetD60_1: D60.1(A) Q24.2(D) T4.4
NetD62_1: D62.1(A1) D62.2(A2) R362.2 U40.6(OUT)
NetD64_1: D64.1(A) T5.3 U41.5(DRAIN)
NetD66_1: D66.1(A) T5.7
NetD66_2: D66.2(K) R383.1
NetD67_1: D67.1 R13.1
NetH?#1_1: H?#1.1 R17.1 V2.2(C)
NetH?#2_1: H?#2.1 R14.1 V1.2(C)
NetJ3_21: J3.21 R70.2
NetJ3_29: J3.29 R23.2
NetJ3_30: J3.30 R46.1
NetJ11_1: J11.1 T5.11
NetJ11_2: J11.2 T5.9
NetK1_1: K1.1 K4.4 L2A.2
NetK4_1: K4.1 U8.2(Out)
NetK5_1: K5.1 R311.2
NetK5_4: K5.4 K5.9
NetK5_8: K5.8 R290.2 R321.1 R438.1
NetQ2_1: Q2.1(B) R25.2
NetQ2_2: Q2.2(C) R218.1 R222.1 R224.2
NetQ19_1: Q19.1(B) R222.2 R224.1
NetQ23_1: Q23.1(B) Q25.2(C) R358.2
NetQ24_1: Q24.1(G) R362.1 R364.1
NetQ24_3: Q24.3(S) R28.1 R30.1 R365.1 R366.1 R372.1
NetR1_2: R1.2 R2.2
NetR2_1: R2.1 R3#2.1
NetR3#1_1: R3#1.1 R397.2
NetR3#2_2: R3#2.2 R4.2
NetR10_2: R10.2 R12.1
NetR12_2: R12.2 R16.1
NetR16_2: R16.2 R20.1
NetR18_2: R18.2 V1.1(B)
NetR19_2: R19.2 V2.1(B)
NetR39_1: R39.1 R41.2
NetR41_1: R41.1 R42.2
NetR42_1: R42.1 R44.2
NetR45_2: R45.2 R352.1
NetR199_1: R199.1 U26.1(IN1)
NetR200_1: R200.1 U26.2(IN2)
NetR201_1: R201.1 U26.3(IN3)
NetR202_1: R202.1 U26.4(IN4)
NetR203_1: R203.1 U26.5(IN5)
NetR204_1: R204.1 U26.6(IN6)
NetR205_1: R205.1 U26.7(IN7)
NetR240_1: R240.1 R420.2
NetR241_2: R241.2 R242.1
NetR242_2: R242.2 R243.1
NetR243_2: R243.2 R244.1
NetR245_2: R245.2 R421.2
NetR246_2: R246.2 R247.1
NetR247_2: R247.2 R248.1
NetR248_2: R248.2 R249.1
NetR261_2: R261.2 R262.1
NetR262_2: R262.2 R263.1
NetR263_2: R263.2 R264.1
NetR267_2: R267.2 R268.1
NetR268_2: R268.2 R269.1
NetR269_2: R269.2 R270.1
NetR290_1: R290.1 R291.2
NetR291_1: R291.1 R292.2
NetR292_1: R292.1 R293.2
NetR294_1: R294.1 R440.2
NetR294_2: R294.2 R295.1
NetR318_1: R318.1 R319.2
NetR319_1: R319.1 R320.2
NetR320_1: R320.1 R321.2
NetR322_2: R322.2 R323.2
NetR323_1: R323.1 R324.1
NetR324_2: R324.2 R325.2
NetR326_2: R326.2 R327.2
NetR327_1: R327.1 R328.1
NetR328_2: R328.2 R329.2
NetR360_2: R360.2 R361.2
NetR376_1: R376.1 R378.2
NetR376_2: R376.2 R377.1
NetR378_1: R378.1 R379.2
NetR379_1: R379.1 R381.2
NetR381_1: R381.1 R382.2
NetR385_1: R385.1 R426.1 U41.3(CS)
NetR390_2: R390.2 R391.1
NetR391_2: R391.2 R392.1
NetR394_2: R394.2 U44.4
NetR395_2: R395.2 U44.1
NetR420_1: R420.1 U1.12(Vout)
NetR421_1: R421.1 U1.11(Vfef)
NetR424_2: R424.2 U8.11(Vfef)
NetR425_2: R425.2 U8.12(Vout)
NetR435_1: R435.1 R436.2
NetR436_1: R436.1 R437.2
NetR438_2: R438.2 R439.1
NetR439_2: R439.2 R440.1
NetU34_6: U34.6(-INB) U34.7(OUTB)

Not connected (* = marked no-connect by the designer): C157 2; D56 2(NC)*; D58 2(NC)*; D59 2(NC)*; D72 1(A)*; J3 3 20; K5 3* 10*; L13 1*; R23 1*; R46 2*; R70 1*; U41 4(NC)*

## Layout directives
mark named Check: NetJ3_3

## Notes on the sheet
- (in symbol HFD3--V/4.5) -; +
- (in symbol LM358N/NOPB) A; B
- (in symbol TL431) K; R; A
- (in symbol Tranf6) SCREEN; W2; 3.3-6V , 4.5W; W1; 120-385V; W3

## Library data of the parts
376 R1 R2 R3#1 R3#2 R4 R10 R12-R14 R16-R21 R24-R26 R28 R30 R39 R41 R42 R44 R45 R50 R51 R189-R191 R199-R205 R207-R209 R218 R219 R221 R222 R224 R231 R232 R239-R249 R251 R261-R264 R267-R270 R290-R295 R311 R318-R329 R351 R352 R354-R366 R368-R383 R385-R388 R390-R401 R420 R421 R424-R426 R435-R440 = Res-SMD: Resistor; Manufacturer: Generic Components; Class: Passive; Published: 08/06/2000; Publisher: Altium Hobart Technology Centre
* *?#1-*?#17 PV_+? = Copper
C1-C5 C7 C8 C12 C15 C16 C25 C66 C147 C152 C153 C155 C156 C166-C169 C196 C199 C202-C205 C208-C214 C216-C221 C223-C228 C230-C236 C240-C247 C250 C252-C254 C436 C?#1-C?#3 = CAP-SMD: Value: 33pF
C6 C14 C27 C37 C53 C56 C63 C433#1 C433#2 = CAP-SMD: High Voltage Ceramic Capacitors CS103M; Value: 33pF
C22 C23 = ECWFG2J475KA: Polypropylene Film Capacitor, 305V ac, ±20%, 4.7μF; MF: Panasonic; Value: *; Price: None; Package: MOLDED-2 Panasonic; MP: ECWFG2J475KA; Availability: In Stock; Check_prices: https://www.snapeda.com/parts/ECWFG2J475KA/Panasonic/view-part/?ref=eda; SnapEDA_Link: https://www.snapeda.com/parts/ECWFG2J475KA/Panasonic/view-part/?ref=snap
C143 C157 C158 C206 C207 C229 C248 C249 C312 = Cap - 10x18 - N: Chung_Loai: Cắm; Don_Vi: Con; So_Chan: 2; Ten_Linh_Kien: Tụ Hóa 220uF 10V 6x11MM; Ma_Hang: MH004510; Kieu_Chan: *
C197 = CAP-SMD: WIMA MKS 4 Metallized Polyester (PET) Capacitors; Value: 33pF
C198 C215 C239 = Cap - 10x18 - N: Cắm 100uF 25V; Don_Vi: Con; So_Chan: 2; Ten_Linh_Kien: Tụ Hóa 220uF 10V 6x11MM; Ma_Hang: MH004510; Chung_Loai: Cắm; Kieu_Chan: *
D4 = Varistor B772: Chống sét lan truyền B88069X4880S102(ví dụ); MP: B72220S0301K101; MF: TDK; Purchase-URL: https://pricing.snapeda.com/search/part/B72220S0301K101/?ref=eda; Package: None; SnapEDA_Link: https://www.snapeda.com/parts/B72220S0301K101/TDK/view-part/?ref=snap; Price: None; Availability: In Stock; Value: *; Check_prices: https://www.snapeda.com/parts/B72220S0301K101/TDK/view-part/?ref=eda
D26 D42 D44 D54 = Diode Double: MP: STTH2003CG-TR; Package: None; Price: None; Value: *; Availability: Unavailable
D34 D36 = DIODE ZENNER: Diode Zenner 15V; Value: DFLZ16Q
D35 = DIODE: Value: 1N4007
D53 D55 D60 D64 D66 = DIODE: Diode 1000V/1A SMB; Value: 1N4007
D56 D58 D59 = Diode Zener Sot-95: BZX84-C18(Y6W) Zenner 18V thay the BZT52C18; MF: ON Semiconductor; MP: BZX84-C7V5; SnapEDA_Link: https://www.snapeda.com/parts/BZX84-C7V5/Onsemi/view-part/?ref=snap; Package: SOT-23 NXP Semiconductors; Value: *; Check_prices: https://www.snapeda.com/parts/BZX84-C7V5/Onsemi/view-part/?ref=eda
D57 = DIODE: Diode 1200V/5A; Value: 1N4007
D61 = Dual-Diode_CA_1: BAT54S thay the BAV99:A7; ki_keywords: Dual Diode Common Anode; Value: Dual_Diode_CA; Reference: D; ki_description: Dual Diode Common Anode
D62 = Diode Double: BAS40-06 40V/120mA; MP: STTH2003CG-TR; Package: None; Price: None; Value: *; Availability: Unavailable
D63 D65 D69 = Diode SHHT 506B: 600V/5A Diode SHHT 506B; MF: ON Semiconductor; MP: BZX84-C7V5; SnapEDA_Link: https://www.snapeda.com/parts/BZX84-C7V5/Onsemi/view-part/?ref=snap; Package: SOT-23 NXP Semiconductors; Value: *; Check_prices: https://www.snapeda.com/parts/BZX84-C7V5/Onsemi/view-part/?ref=eda
D67 = LED: LED Single colour Green and Red; Value: LED 3 ly Single Colour
D68 D70-D72 = DIODE: Diode 600V/2A SMB thay the ES2J; Value: 1N4007
H?#1 H?#2 P46 = Header 4P 2.54 Duc Thang: Cắm; Ten_Linh_Kien: Header 4P XH2.54-4P Đực Thẳng; Don_Vi: Con; Ma_Hang: MH001285; Chung_Loai: Cắm
J2 J4 J11 J? = Jump2
J3 = Header 15x2: Header, 15x2-Pin 2.5mm; LatestRevisionDate: 17-Jul-2002; LatestRevisionNote: Re-released for DXP Platform.; Publisher: Altium Limited
K1-K4 = RELAY 10A/250V-HF: HF161F-W 12-HT(477)
K5 = HFD3--V/4.5: MF: Hongfa; MP: HFD3/012-L2; Package: None; Price: None; Value: *; SnapEDA_Link: https://www.snapeda.com/parts/HFD3/012-L2/Hon/view-part/?ref=snap; Availability: In Stock; Check_prices: https://www.snapeda.com/parts/HFD3/012-L2/Hon/view-part/?ref=eda
L1A L1B = CUON CAM PWM Hybrid: Cuận cảm bộ sạc PWM Hybrid; Value: Loc 220; Designed by: VanDungEvn
L2A L2B L4A L4B = IND_18uH-0.12A-10%-SMD: Fixed Inductors 18uH 10% 2.52MHz; Manufacturer: Wurth Electronics; Manufacturer Part Number: CMH322522-180KL; Alternate Part Number-1: NA; Case/Package: SMD; Supplier-1: ARROW; Supplier Part Number-1: CMH322522-180KL
L11-L13 L15 L16 = L1: Inductor; Value: 150 mH
Q2 = D882M: thay the MMPT2222 40V/06A
Q19 = B772M-PNP: thay the B772; Value: C9015
Q23 Q25 = D882M: NPN
Q24 = MOSFET IRF N: 14N30; Value: IRF840
R23 R46 R70 = Res-SMD: No connect; Manufacturer: Generic Components; Class: Passive; Published: 08/06/2000; Publisher: Altium Hobart Technology Centre
RV3 RV7-RV9 = Varistor B772: Varistor 420VAC 8000A(8/20us) B72220S0421K101; MP: B72220S0301K101; MF: TDK; Purchase-URL: https://pricing.snapeda.com/search/part/B72220S0301K101/?ref=eda; Package: None; SnapEDA_Link: https://www.snapeda.com/parts/B72220S0301K101/TDK/view-part/?ref=snap; Price: None; Availability: In Stock; Value: *; Check_prices: https://www.snapeda.com/parts/B72220S0301K101/TDK/view-part/?ref=eda
T4 = Tranf6: Off-Line Transformer WE-UNIT , L=0.9mH; PartNo: 749118205; Manufacturer: Würth Elektronik eiSos GmbH; Inductance: 0.9mH; Turns Ratio: 19:1:1; Input Voltage (AC): 85-265; Output Voltage (DC): 5; Output Current (A): 0.6; ComponentLink1Description: Manufacturer; ComponentLink1URL: http://www.we-online.de; Created by: Otto Christin; Created Date: OCT 2013; ComponentLink2Description: Datasheet; ComponentLink2URL: http://www.we-online.de/katalog/media/pdf/749118205.pdf
T5 = Tranfomer 2-4: Bien ap xung DVD; Designed by: VanDungEvn; Value: BAX
U1 U8 = Current sensor: Bien dong sinomags STK-PL 50 0LSB8 / STK-PL/P1; Value: Loc 220; Designed by: VanDungEvn
U26 = ULN2003A: Power Switch/Driver 1:1 Darlington 500mA 16-SOP; MF: UMW; SnapEDA_Link: https://www.snapeda.com/parts/ULN2003A/Umwelt+Sensor+Teknik/view-part/?ref=snap; Package: None; Value: *; MP: ULN2003A; Check_prices: https://www.snapeda.com/parts/ULN2003A/Umwelt+Sensor+Teknik/view-part/?ref=eda
U34 = LM358N/NOPB: Dual, 32-V, 1-MHz op amp; MF: Texas Instruments; SnapEDA_Link: https://www.snapeda.com/parts/LM358N/NOPB/Texas+Instruments/view-part/?ref=snap; Package: PDIP-8 Texas; MP: LM358N/NOPB; Check_prices: https://www.snapeda.com/parts/LM358N/NOPB/Texas+Instruments/view-part/?ref=eda; Purchase-URL: https://pricing.snapeda.com/search/part/LM358N/NOPB/?ref=eda; Price: None; Value: *; Availability: In Stock
U40 = UC3843BVD1G: MF: ON Semiconductor; Package: SOIC-8 ON Semiconductor; Price: None; Check_prices: https://www.snapeda.com/parts/UC3843BVD1G/Onsemi/view-part/?ref=eda; Value: *; SnapEDA_Link: https://www.snapeda.com/parts/UC3843BVD1G/Onsemi/view-part/?ref=snap; MP: UC3843BVD1G; Availability: In Stock; Purchase-URL: https://pricing.snapeda.com/search?q=UC3843BVD1G&ref=eda
U41 = ICE3AR0680jz: HIGH PERFORMANCE CURRENT MODE PWM CONTROLLER; MP: UC2845BD1; Package: None; Price: None; Value: *; Availability: Unavailable
U42 = AZ1117CR-3.3: IC 5V thay the 78M05; Note: Tab is connected to pin 3 (GND).; Published: 24-Aug-2001; LatestRevisionDate: 17-Jul-2002; LatestRevisionNote: Re-released for DXP Platform.; DatasheetVersion: Apr-1994; PackageReference: SOT82C; Publisher: Altium Limited; PackageDescription: SIP; 3 Leads; Body 10.9 x 7.6 x 2.6 mm (typ); Pitch 2.2 mm; ComponentLink1Description: Manufacturer Link; ComponentLink1URL: http://www.st.com/; ComponentLink2Description: Datasheet; ComponentLink2URL: http://www.st.com/stonline/products/literature/ds/2146/l78m05c.pdf
U43 = 7133_1: IC -12V; Note: Tab is connected to pin 3 (GND).; Published: 24-Aug-2001; LatestRevisionDate: 17-Jul-2002; LatestRevisionNote: Re-released for DXP Platform.; DatasheetVersion: Apr-1994; PackageReference: SOT82C; Publisher: Altium Limited; PackageDescription: SIP; 3 Leads; Body 10.9 x 7.6 x 2.6 mm (typ); Pitch 2.2 mm; ComponentLink1Description: Manufacturer Link; ComponentLink1URL: http://www.st.com/; ComponentLink2Description: Datasheet; ComponentLink2URL: http://www.st.com/stonline/products/literature/ds/2146/l78m05c.pdf
U44 = VOM617A-2T: OPTOISOLATOR 3.75KV TRANS 4-SOP; Solder: SMT; CompanyID: VT-xxxx; MPN: VOM617A-2T; Value: VOM617A-2T
U45 = TL431: SOIC 8 TL431BD
V1 V2 = D882M